# Altium schematic sheet Decoration.SchDoc
size A4; DocumentNumber: 1; SheetNumber: 1
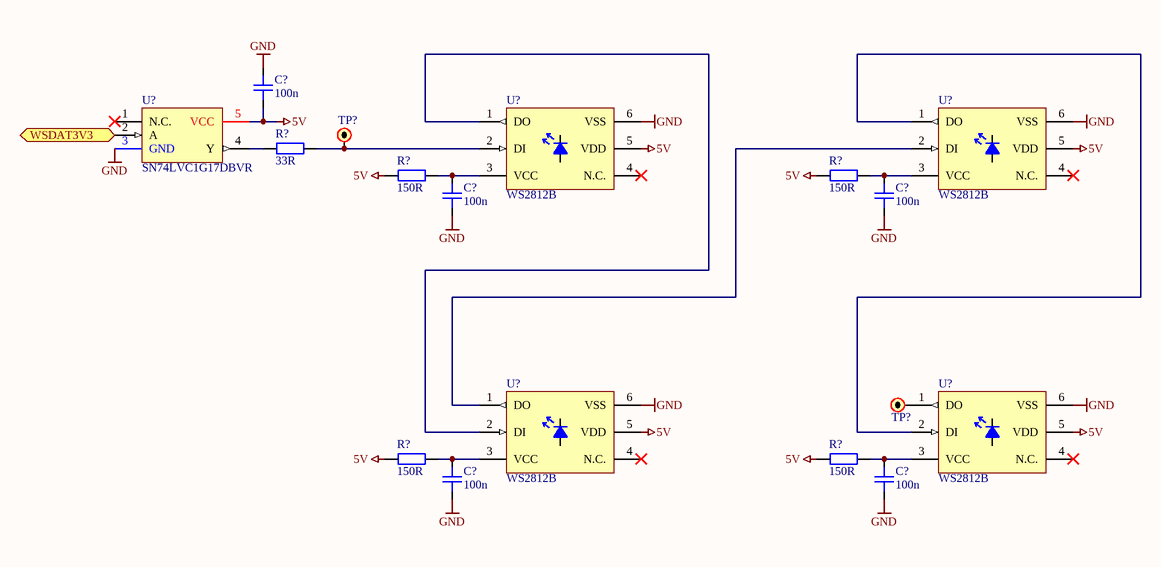
[diagram p0: Decoration.SchDoc]

## Parts
(Parts that share a designator on the sheet are numbered #1, #2 ... from top to bottom, then left to right.)
C?#1  100n  [0805C_RF_M]
C?#2  100n  [0805C_RF_M]
C?#3  100n  [0805C_RF_M]
C?#4  100n  [0805C_RF_M]
C?#5  100n  [0805C_RF_M]
R?#1  33R  [0805R_RF_M]
R?#2  150R  [0603R_RF_M]
R?#3  150R  [0603R_RF_M]
R?#4  150R  [0603R_RF_M]
R?#5  150R  [0603R_RF_M]
TP?#1  Test Point  [PAD_R_1MM]  (value not drawn)
TP?#2  Test Point  [PAD_R_1.5MM]  (value not drawn)
U?#1  WS2812B  [WS2812B]
U?#2  WS2812B  [WS2812B]
U?#3  SN74LVC1G17DBVR  [TI_SOT-23-5]
U?#4  WS2812B  [WS2812B]
U?#5  WS2812B  [WS2812B]

## Ports
WSDAT3V3 (in)

## Nets
5V: C?#1.2 R?#2.1 R?#3.1 R?#4.1 R?#5.1 U?#1.5(VDD) U?#2.5(VDD) U?#3.5(VCC) U?#4.5(VDD) U?#5.5(VDD)
GND: C?#1.1 C?#2.1 C?#3.1 C?#4.1 C?#5.1 U?#1.6(VSS) U?#2.6(VSS) U?#3.3(GND) U?#4.6(VSS) U?#5.6(VSS)
WSDAT3V3: U?#3.2(A) ; port WSDAT3V3
NetC?#2_2: C?#2.2 R?#2.2 U?#1.3(VCC)
NetC?#3_2: C?#3.2 R?#3.2 U?#2.3(VCC)
NetC?#4_2: C?#4.2 R?#4.2 U?#4.3(VCC)
NetC?#5_2: C?#5.2 R?#5.2 U?#5.3(VCC)
NetR?#1_1: R?#1.1 U?#3.4(Y)
NetR?#1_2: R?#1.2 TP?#1.1 U?#1.2(DI)
NetTP?#2_1: TP?#2.1 U?#5.1(DO)
NetU?#1_1: U?#1.1(DO) U?#4.2(DI)
NetU?#2_1: U?#2.1(DO) U?#5.2(DI)
NetU?#2_2: U?#2.2(DI) U?#4.1(DO)

Not connected (* = marked no-connect by the designer): U?#1 4(N.C.)*; U?#2 4(N.C.)*; U?#3 1(N.C.)*; U?#4 4(N.C.)*; U?#5 4(N.C.)*

## Notes on the sheet
- Author
- Date
- Revision
- Size
- A4
- Sheet
- of

## Library data of the parts
C?#1-C?#5 = C: Capacitor; Manufacturer: Generic Brand; Max Voltage: ? V; Value: 100n; Tolerance: ?; Mounting Technology: SMT; Tag: *; Manufacturer Part No: *; Supplier: *; Supplier Link: http://; Supplier Part No: *; Category: Capacitor
R?#1-R?#5 = R: Resistor; Manufacturer: Generic Brand; Power Rating: ? W; Max Voltage: ? V; Tolerance: ?; Supplier Link: http://; Category: Resistor; Mounting Technology: SMT
  R?#1: Value: 33R
  R?#2-R?#5: Value: 150R
TP?#1 TP?#2 = Test Point: Test Point / Pad
U?#3 = SN74LVC1G17DBVR: IC BUF NON-INVERT 5.5V SOT23-5; Manufacturer: Texas Instruments; Supplier Part No: 296-11933-1-ND; Supplier URL: https://www.digikey.com/en/products/detail/texas-instruments/SN74LVC1G17DBVR/389051; Supplier Unit Price: $0.29; Supplier Packaging: Cut Tape; Manufacturer Product Number: SN74LVC1G17DBVR; Operating Temperature: -40°C ~ 125°C (TA); Mounting Type: SMT; Package: SOT-23-5